# Altium schematic sheet VALVEBOARD_Top.SchDoc
size A4; SheetNumber: 1; SheetTotal: 9
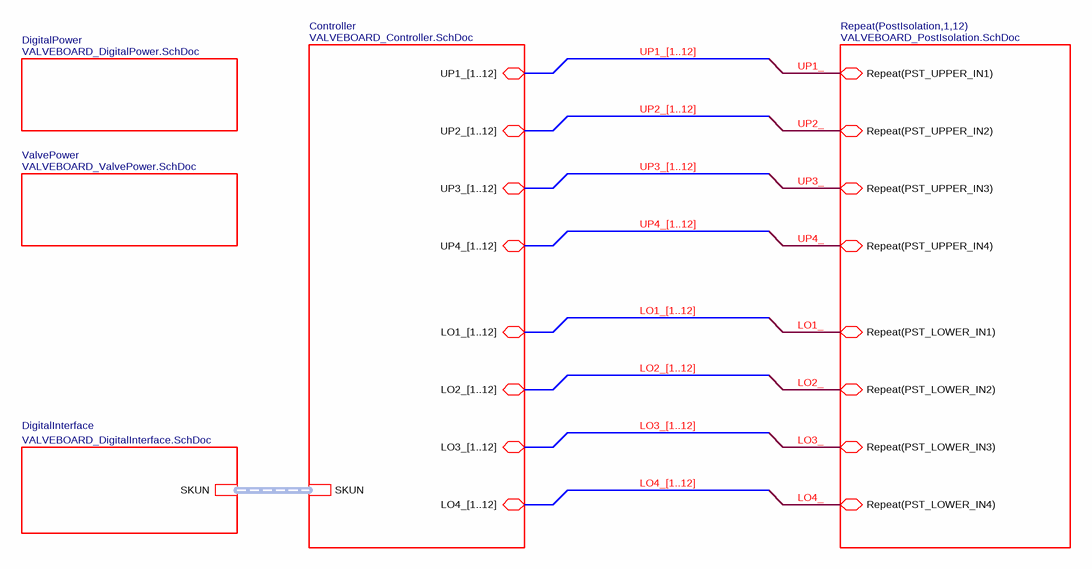
[diagram p0: VALVEBOARD_Top.SchDoc]

## Sub-sheets
Controller = VALVEBOARD_Controller.SchDoc: UP1_[1..12] (bidir), UP2_[1..12] (bidir), UP3_[1..12] (bidir), UP4_[1..12] (bidir), LO1_[1..12] (bidir), LO2_[1..12] (bidir), LO3_[1..12] (bidir), LO4_[1..12] (bidir), SKUN
DigitalInterface = VALVEBOARD_DigitalInterface.SchDoc: SKUN (harness SKUN_TYPE)
DigitalPower = VALVEBOARD_DigitalPower.SchDoc: no entries
Repeat(PostIsolation,1,12) = VALVEBOARD_PostIsolation.SchDoc: Repeat(PST_UPPER_IN1) (bidir), Repeat(PST_UPPER_IN2) (bidir), Repeat(PST_UPPER_IN3) (bidir), Repeat(PST_UPPER_IN4) (bidir), Repeat(PST_LOWER_IN1) (bidir), Repeat(PST_LOWER_IN2) (bidir), Repeat(PST_LOWER_IN3) (bidir), Repeat(PST_LOWER_IN4) (bidir)
ValvePower = VALVEBOARD_ValvePower.SchDoc: no entries

## Nets
LO1_: sheet Repeat(PostIsolation,1,12)/Repeat(PST_LOWER_IN1)
LO2_: sheet Repeat(PostIsolation,1,12)/Repeat(PST_LOWER_IN2)
LO3_: sheet Repeat(PostIsolation,1,12)/Repeat(PST_LOWER_IN3)
LO4_: sheet Repeat(PostIsolation,1,12)/Repeat(PST_LOWER_IN4)
UP1_: sheet Repeat(PostIsolation,1,12)/Repeat(PST_UPPER_IN1)
UP2_: sheet Repeat(PostIsolation,1,12)/Repeat(PST_UPPER_IN2)
UP3_: sheet Repeat(PostIsolation,1,12)/Repeat(PST_UPPER_IN3)
UP4_: sheet Repeat(PostIsolation,1,12)/Repeat(PST_UPPER_IN4)

## Buses and harness runs
bus LO1_[1..12] = sheet Controller/LO1_[1..12]
bus LO2_[1..12] = sheet Controller/LO2_[1..12]
bus LO3_[1..12] = sheet Controller/LO3_[1..12]
bus LO4_[1..12] = sheet Controller/LO4_[1..12]
bus UP1_[1..12] = sheet Controller/UP1_[1..12]
bus UP2_[1..12] = sheet Controller/UP2_[1..12]
bus UP3_[1..12] = sheet Controller/UP3_[1..12]
bus UP4_[1..12] = sheet Controller/UP4_[1..12]
harness sheet Controller/SKUN = sheet DigitalInterface/SKUN